# EAGLE design humidity (EAGLE 5.11)
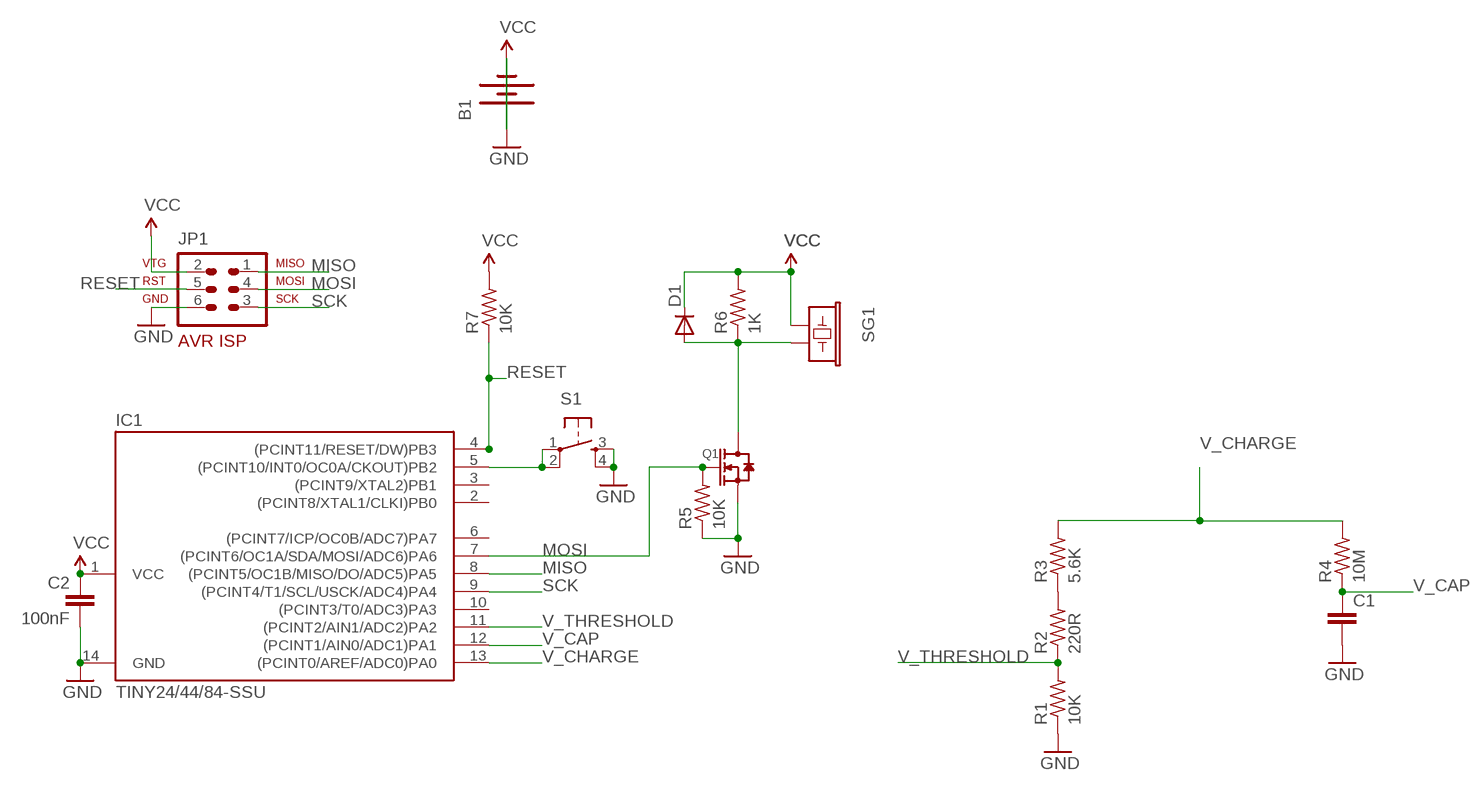
[diagram p0: schematic, sheet 1]

## Parts
B1  BATTERY20SMD  [BATTCON_20MM]
C1  CAPSMD  [GRM43D]
C2  100nF  C-EUC0805  [C0805]
D1  DIODE-SCHOTTKY_  DIODESOD  [SOD-323]
IC1  TINY24/44/84-SSU  [SOIC14]
JP1  AVR-ISP-6  [AVR-ISP-6]
Q1  MOSFET-N-SOT23  [SOT23]
R1  10K  R-US_R0805W  [R0805W]
R2  220R  R-US_R0805W  [R0805W]
R3  5.6K  R-US_R0805W  [R0805W]
R4  10M  R-US_R0805W  [R0805W]
R5  10K  R-US_R0805  [R0805]
R6  1K  R-US_R0805  [R0805]
R7  10K  R-US_R0805  [R0805]
S1  TAC_SWITCHSMD  [TACTILE_SWITCH_SMD]
SG1  BUZZERPTH  [BUZZER-12MM]

## Nets
GND: B1.2(-) C1.C C2.2 IC1.14(GND) JP1.6 Q1.2(S) R1.1 R5.1 S1.3 S1.4
MISO: IC1.8((PCINT5/OC1B/MISO/DO/ADC5)PA5) JP1.1
MOSI: IC1.7((PCINT6/OC1A/SDA/MOSI/ADC6)PA6) JP1.4 Q1.1(G) R5.2
N$1: D1.2(A) Q1.3(D) R6.1 SG1.-
N$2: IC1.5((PCINT10/INT0/OC0A/CKOUT)PB2) S1.1 S1.2
N$3: R2.2 R3.1
RESET: IC1.4((PCINT11/RESET/DW)PB3) JP1.5 R7.1
SCK: IC1.9((PCINT4/T1/SCL/USCK/ADC4)PA4) JP1.3
V_CAP: C1.A IC1.12((PCINT1/AIN0/ADC1)PA1) R4.1
V_CHARGE: IC1.13((PCINT0/AREF/ADC0)PA0) R3.2 R4.2
V_THRESHOLD: IC1.11((PCINT2/AIN1/ADC2)PA2) R1.2 R2.1
VCC: B1.1(+) C2.1 D1.1(C) IC1.1(VCC) JP1.2 R6.2 R7.2 SG1.+
Unconnected: IC1.2((PCINT8/XTAL1/CLKI)PB0) IC1.3((PCINT9/XTAL2)PB1) IC1.6((PCINT7/ICP/OC0B/ADC7)PA7) IC1.10((PCINT3/T0/ADC3)PA3)

## Library data of the parts
B1 = SparkFun:BATTERY: Battery Holders Various common sizes : AA, AAA, 20mm coin cell and 12mm coin cell.
C1 = SparkFun:CAP: Capacitor Standard 0603 ceramic capacitor, and 0.1" leaded capacitor.
C2 = rcl:C-EU: CAPACITOR, European symbol
D1 = SparkFun:DIODE: Diode These are standard reverse protection diodes and small signal diodes. SMA package can handle up to about 1A. SOD-323 can handle about 200mA. What the SOD-323 package when ordering, there are some mfgs out there that are 5-pin packages.
IC1 = avr-5:TINY24/44/84
JP1 = avr-5:AVR-ISP-6: AVR ISP-6 Serial Programming Header
Q1 = Seeed-Discrete:MOSFET-N
R1-R7 = rcl:R-US_: RESISTOR, American symbol
S1 = SparkFun:TAC_SWITCH: Momentary Switch Button commonly used for reset or general input. Spark Fun Electronics SKU : COM-00097
SG1 = SparkFun:BUZZER: Buzzer 12mm Spark Fun Electronics SKU : Comp-Buzzer

## Board
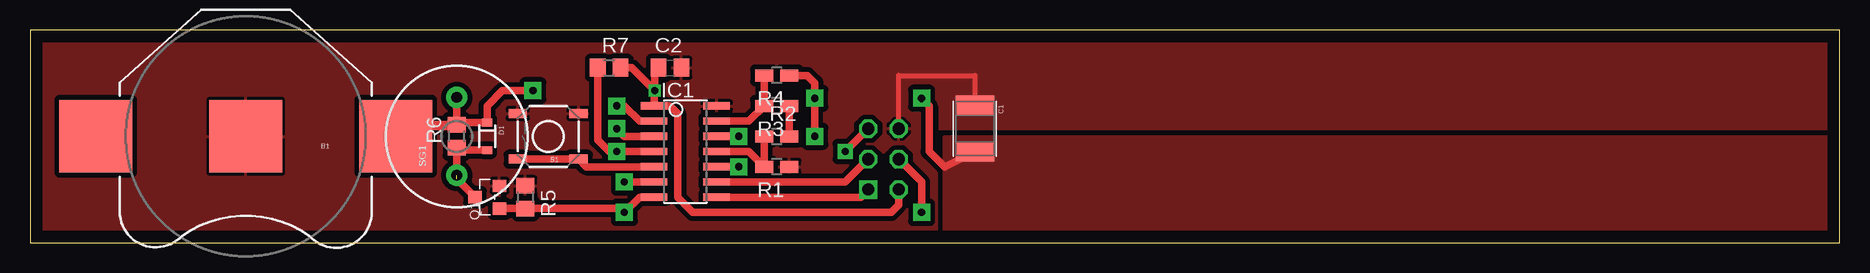
[diagram p1: board, top side]
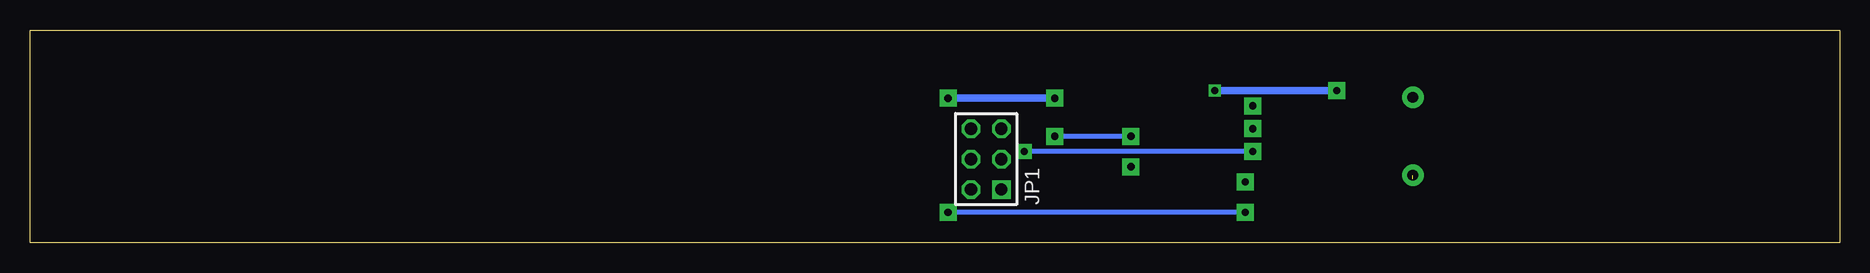
[diagram p2: board, bottom side, seen from below]

Size 150.8 x 17.77 mm. Coordinates in mm from the lower left corner, seen from the top.
Outline: 0,0 150.8,0 150.8,17.77 0,17.77 0,0
Copper layers (1*16): Top 0.035mm / dielectric 1.5mm / Bottom 0.035mm
Design rules "default": minimum track width 10mil, minimum drill 24mil, track to track 8mil, track to pad 8mil, pad to pad 8mil, via to via 8mil, smd to smd 8mil, copper to edge 40mil, drill to drill 8mil, minimum pad ring 10mil, minimum via ring 8mil, stop-mask expansion 4mil, vias tented up to drill 0mil, thermal gap 10mil

### Footprints (pad centres in the part's own frame; a part is rotated, then mirrored left to right if it is on the bottom)
BATTCON_20MM = smd 6.07 x 6.07: 1 -12.5,0; 2 0,0; 3 12.5,0
GRM43D = smd 1.65 x 3.2: A 1.927,0; C -1.927,0
C0805 = smd 1.3 x 1.5: 1 -0.95,0; 2 0.95,0
SOD-323 = smd 0.63 x 0.83: 1 -1.15,0; 2 1.15,0
SOIC14 = smd 0.61 x 2.21: 1 -3.81,-2.603; 2 -2.54,-2.603; 3 -1.27,-2.603; 4 0,-2.603; 5 1.27,-2.603; 6 2.54,-2.603; 7 3.81,-2.603; 8 3.81,2.603; 9 2.54,2.603; 10 1.27,2.603; 11 0,2.603; 12 -1.27,2.603; 13 -2.54,2.603; 14 -3.81,2.603
AVR-ISP-6 = drill 1.016 square: 1 -2.54,-1.27 | drill 1.016 octagon: 2 -2.54,1.27; 3 0,-1.27; 4 0,1.27; 5 2.54,-1.27; 6 2.54,1.27
SOT23 = smd 1.016 x 1.143: 1 -0.95,-1.016; 2 0.95,-1.016; 3 0,1.016
R0805W = smd 1.5 x 1: 1 -1.052,0; 2 1.052,0
R0805 = smd 1.3 x 1.5: 1 -0.95,0; 2 0.95,0
TACTILE_SWITCH_SMD = smd 1.524 x 0.762: 1 -2.54,1.905; 2 2.54,1.905; 3 -2.54,-1.905; 4 2.54,-1.905
BUZZER-12MM = drill 0.9 pad 1.778 round: + 3.25,0; - -3.25,0

### Placement (x,y rotation side)
B1  17.98,8.89 180 top
C1  78.74,9.53 270 top
C2  53.34,14.61 0 top
D1  38.1,8.89 270 top
IC1  54.61,7.62 270 top
JP1  71.12,6.99 90 bottom
Q1  38.1,3.81 90 top
R1  62.23,6.35 180 top
R2  62.23,8.89 0 top
R3  62.23,11.43 180 top
R4  62.23,13.97 180 top
R5  41.28,3.81 270 top
R6  35.56,8.89 90 top
R7  48.26,14.61 0 top
S1  43.18,8.89 180 top
SG1  35.56,8.89 90 top

### Tracks (layer width: path | path; a pad name or v marks a point on that pad's centre or on a via)
GND
  Top 0.406: JP1.6 72.39,13.97 78.74,13.97 C1.C
  pour Top (isolate 0.406): 0,17.78 0,0 75.56,0 75.56,17.78
  pour Top (isolate 0.406, no thermals): 75.56,9.53 149.86,9.53 149.86,17.78 75.56,17.14
MISO
  Top 0.61: JP1.1 69.22,3.81 IC1.8
MOSI  (via drill 0.6 pad 1.42)
  Top 0.61: v74.3,2.54 74.3,5.08 JP1.4 | IC1.7 50.8,3.81 v49.53,2.54 49.21,2.86 R5.2 Q1.1
  Bottom 0.406: v49.53,2.54 v74.3,2.54
N$1  (1 unrouted)
  Top 0.61: Q1.3 35.56,5.33 R6.1 35.86,7.74 D1.2
N$2
  Top 0.61: S1.2 S1.1 46.36,6.35 IC1.5
N$3
  Top 0.61: R2.2 R3.1
N$4  (via drill 0.6 pad 1.42)
  Top 0.61: 52.07,8.89 49.53,8.89 v48.9,9.53
N$6  (via drill 0.6 pad 1.42)
  Top 0.61: v49.53,5.08 52.07,5.08
N$7  (via drill 0.6 pad 1.42)
  Top 0.61: v59.05,6.35 57.15,6.35
N$8  (via drill 0.6 pad 1.42)
  Top 0.61: 52.07,10.16 50.8,10.16 49.53,11.43 v48.9,11.43
RESET  (via drill 0.6 pad 1.27, 0.6 pad 1.42)
  Top 0.61: IC1.4 v48.9,7.62 48.26,7.62 47.31,8.57 R7.1 | v67.95,7.62 JP1.5
  Bottom 0.406: v48.9,7.62 v67.95,7.62
SCK
  Top 0.61: JP1.3 67.95,5.08 IC1.9
V_CAP  (via drill 0.6 pad 1.42)
  Top 0.61: IC1.12 v59.05,8.89 | R4.1 64.77,13.97 65.41,13.34 v65.41,12.06 v65.41,8.89 | C1.A 76.22,6.33 74.93,7.62 74.93,11.43 v74.3,12.06
  Bottom 0.406: v59.05,8.89 v65.41,8.89
  Bottom 0.61: v65.41,12.06 v74.3,12.06
  pour Top (isolate 0.406, no thermals): 76.2,8.89 149.86,8.89 149.86,0.64 76.2,0.64
V_CHARGE
  Top 0.61: R4.2 R3.2 59.91,10.16 IC1.13
V_THRESHOLD
  Top 0.61: R2.1 R1.2 59.91,7.62 IC1.11
VCC  (via drill 0.6, 0.6 pad 1.42)
  Top 0.406: R6.2 35.86,10.04
  Top 0.61: 35.86,10.04 D1.1 38.1,11.43 39.37,12.7 v41.91,12.7 | v52.07,12.7 52.01,12.64 IC1.1 53.34,11.43 53.98,10.79 53.98,3.81 55.25,2.54 71.75,2.54 72.39,3.17 JP1.2 | R6.2 SG1.+ | v52.07,12.7 52.07,14.29 C2.1 | R7.2 50.16,14.61 v52.07,12.7
  Top 0.813: B1.1 28.79,9.74 R6.2
  Bottom 0.61: v41.91,12.7 v52.07,12.7